# Altium schematic sheet Dionysus_FPGA.SchDoc: FPGA
size B; CompanyName: Cospan Design; DrawnBy: David McCoy; Engineer: David McCoy; DocumentNumber: 2; Revision: B; SheetNumber: 2; SheetTotal: 8
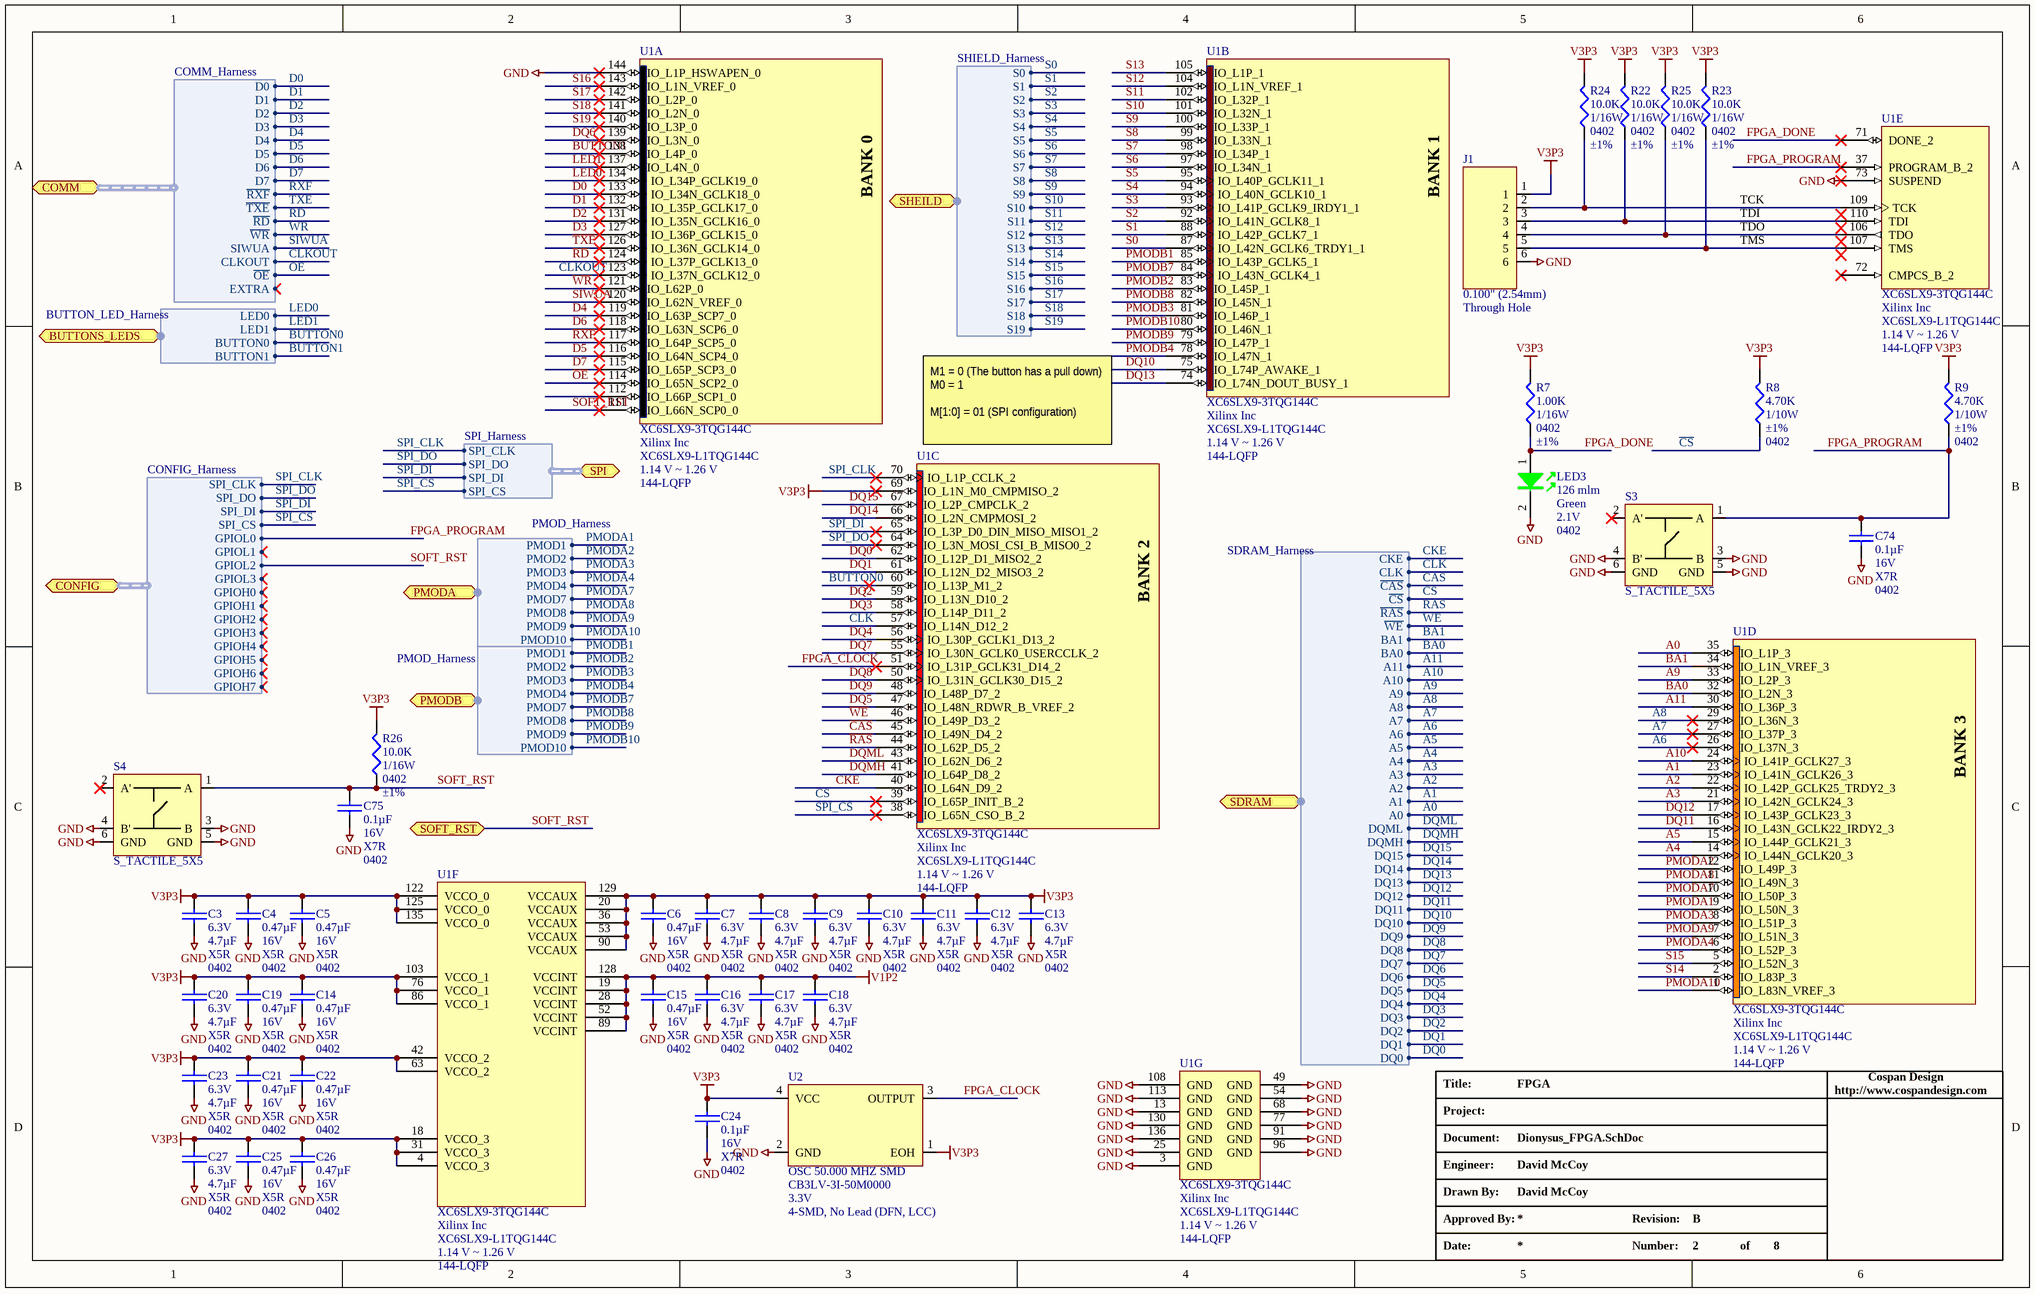
[diagram p0: Dionysus_FPGA.SchDoc]

## Parts
C3  Voltage - Rated: 6.3V  Capacitance: 4.7µF  Temperature Coefficient: X5R  Package / Case: 0402  [C_ERA-0402]  (hidden comment: 4.7uF)
C4  Capacitance: 0.47µF  Voltage - Rated: 16V  Temperature Coefficient: X5R  Package / Case: 0402  [C_ERA-0402]  (hidden comment: 0.47uF)
C5  Capacitance: 0.47µF  Voltage - Rated: 16V  Temperature Coefficient: X5R  Package / Case: 0402  [C_ERA-0402]  (hidden comment: 0.47uF)
C6  Capacitance: 0.47µF  Voltage - Rated: 16V  Temperature Coefficient: X5R  Package / Case: 0402  [C_ERA-0402]  (hidden comment: 0.47uF)
C7  Voltage - Rated: 6.3V  Capacitance: 4.7µF  Temperature Coefficient: X5R  Package / Case: 0402  [C_ERA-0402]  (hidden comment: 4.7uF)
C8  Voltage - Rated: 6.3V  Capacitance: 4.7µF  Temperature Coefficient: X5R  Package / Case: 0402  [C_ERA-0402]  (hidden comment: 4.7uF)
C9  Voltage - Rated: 6.3V  Capacitance: 4.7µF  Temperature Coefficient: X5R  Package / Case: 0402  [C_ERA-0402]  (hidden comment: 4.7uF)
C10  Voltage - Rated: 6.3V  Capacitance: 4.7µF  Temperature Coefficient: X5R  Package / Case: 0402  [C_ERA-0402]  (hidden comment: 4.7uF)
C11  Voltage - Rated: 6.3V  Capacitance: 4.7µF  Temperature Coefficient: X5R  Package / Case: 0402  [C_ERA-0402]  (hidden comment: 4.7uF)
C12  Voltage - Rated: 6.3V  Capacitance: 4.7µF  Temperature Coefficient: X5R  Package / Case: 0402  [C_ERA-0402]  (hidden comment: 4.7uF)
C13  Voltage - Rated: 6.3V  Capacitance: 4.7µF  Temperature Coefficient: X5R  Package / Case: 0402  [C_ERA-0402]  (hidden comment: 4.7uF)
C14  Capacitance: 0.47µF  Voltage - Rated: 16V  Temperature Coefficient: X5R  Package / Case: 0402  [C_ERA-0402]  (hidden comment: 0.47uF)
C15  Capacitance: 0.47µF  Voltage - Rated: 16V  Temperature Coefficient: X5R  Package / Case: 0402  [C_ERA-0402]  (hidden comment: 0.47uF)
C16  Voltage - Rated: 6.3V  Capacitance: 4.7µF  Temperature Coefficient: X5R  Package / Case: 0402  [C_ERA-0402]  (hidden comment: 4.7uF)
C17  Voltage - Rated: 6.3V  Capacitance: 4.7µF  Temperature Coefficient: X5R  Package / Case: 0402  [C_ERA-0402]  (hidden comment: 4.7uF)
C18  Voltage - Rated: 6.3V  Capacitance: 4.7µF  Temperature Coefficient: X5R  Package / Case: 0402  [C_ERA-0402]  (hidden comment: 4.7uF)
C19  Capacitance: 0.47µF  Voltage - Rated: 16V  Temperature Coefficient: X5R  Package / Case: 0402  [C_ERA-0402]  (hidden comment: 0.47uF)
C20  Voltage - Rated: 6.3V  Capacitance: 4.7µF  Temperature Coefficient: X5R  Package / Case: 0402  [C_ERA-0402]  (hidden comment: 4.7uF)
C21  Capacitance: 0.47µF  Voltage - Rated: 16V  Temperature Coefficient: X5R  Package / Case: 0402  [C_ERA-0402]  (hidden comment: 0.47uF)
C22  Capacitance: 0.47µF  Voltage - Rated: 16V  Temperature Coefficient: X5R  Package / Case: 0402  [C_ERA-0402]  (hidden comment: 0.47uF)
C23  Voltage - Rated: 6.3V  Capacitance: 4.7µF  Temperature Coefficient: X5R  Package / Case: 0402  [C_ERA-0402]  (hidden comment: 4.7uF)
C24  Capacitance: 0.1µF  Voltage - Rated: 16V  Temperature Coefficient: X7R  Package / Case: 0402  [C_ERA-0402]  (hidden comment: 0.1uF)
C25  Capacitance: 0.47µF  Voltage - Rated: 16V  Temperature Coefficient: X5R  Package / Case: 0402  [C_ERA-0402]  (hidden comment: 0.47uF)
C26  Capacitance: 0.47µF  Voltage - Rated: 16V  Temperature Coefficient: X5R  Package / Case: 0402  [C_ERA-0402]  (hidden comment: 0.47uF)
C27  Voltage - Rated: 6.3V  Capacitance: 4.7µF  Temperature Coefficient: X5R  Package / Case: 0402  [C_ERA-0402]  (hidden comment: 4.7uF)
C74  Capacitance: 0.1µF  Voltage - Rated: 16V  Temperature Coefficient: X7R  Package / Case: 0402  [C_ERA-0402]  (hidden comment: 0.1uF)
C75  Capacitance: 0.1µF  Voltage - Rated: 16V  Temperature Coefficient: X7R  Package / Case: 0402  [C_ERA-0402]  (hidden comment: 0.1uF)
J1  Pitch: 0.100" (2.54mm)  Mounting Type: Through Hole  [HDR_1X6]  (hidden comment: J_HDR1X6_THRHOLE_VERT)
LED3  Luminous Flux @ Current - Test: 126 mlm  Color: Green  Voltage - Forward (Vf) Typ: 2.1V  Package / Case: 0402  [DIOM1005X07L_GREEN]  (hidden comment: LED_GRN_0402)
R7  Resistance In Ohms: 1.00K  Power (Watts): 1/16W  Case: 0402  Tolerance: ±1%  [ERA-0402]  (hidden comment: 1.0k Ohms)
R8  Resistance In Ohms: 4.70K  Power (Watts): 1/10W  Tolerance: ±1%  Case: 0402  [ERA-0402]  (hidden comment: 4.7k Ohms)
R9  Resistance In Ohms: 4.70K  Power (Watts): 1/10W  Tolerance: ±1%  Case: 0402  [ERA-0402]  (hidden comment: 4.7k Ohms)
R22  Resistance In Ohms: 10.0K  Power (Watts): 1/16W  Case: 0402  Tolerance: ±1%  [ERA-0402]  (hidden comment: R_0402_10.0K)
R23  Resistance In Ohms: 10.0K  Power (Watts): 1/16W  Case: 0402  Tolerance: ±1%  [ERA-0402]  (hidden comment: R_0402_10.0K)
R24  Resistance In Ohms: 10.0K  Power (Watts): 1/16W  Case: 0402  Tolerance: ±1%  [ERA-0402]  (hidden comment: R_0402_10.0K)
R25  Resistance In Ohms: 10.0K  Power (Watts): 1/16W  Case: 0402  Tolerance: ±1%  [ERA-0402]  (hidden comment: R_0402_10.0K)
R26  Resistance In Ohms: 10.0K  Power (Watts): 1/16W  Case: 0402  Tolerance: ±1%  [ERA-0402]  (hidden comment: R_0402_10.0K)
S3  S_TACTILE_5X5  [TACTILE_BUTTON_5X5]
S4  S_TACTILE_5X5  [TACTILE_BUTTON_5X5]
U1  XC6SLX9-3TQG144C  Manufacturer: Xilinx Inc  Manufacturer Part Number: XC6SLX9-L1TQG144C  Voltage - Supply: 1.14 V ~ 1.26 V  Package / Case: 144-LQFP  [TQG144_N]  (parts A,B,C,D,E,F,G of 7)
U2  OSC 50.000 MHZ SMD  Manufacturer Part Number: CB3LV-3I-50M0000  Supply Voltage: 3.3V  Package / Case: 4-SMD, No Lead (DFN, LCC)  [SMD_OSC_12MHZ]

## Ports
BUTTONS_LEDS (harness BUTTON_LED_Harness), COMM (harness COMM_Harness), CONFIG (harness CONFIG_Harness), PMODA (harness PMOD_Harness), PMODB (harness PMOD_Harness), SDRAM (harness SDRAM_Harness), SHEILD (harness SHIELD_Harness), SOFT_RST, SPI (harness SPI_Harness)

## Harnesses
CONFIG_Harness: SPI_CLK, SPI_DO, SPI_DI, SPI_CS, GPIOL0, GPIOL1, GPIOL2, GPIOL3, GPIOH0, GPIOH1, GPIOH2, GPIOH3, GPIOH4, GPIOH5, GPIOH6, GPIOH7
COMM_Harness: D0, D1, D2, D3, D4, D5, D6, D7, ~{RXF}, ~{TXE}, ~{RD}, ~{WR}, SIWUA, CLKOUT, ~{OE}, EXTRA
BUTTON_LED_Harness: LED0, LED1, BUTTON0, BUTTON1
SDRAM_Harness: CKE, CLK, ~{CAS}, ~{CS}, ~{RAS}, ~{WE}, BA1, BA0, A11, A10, A9, A8, A7, A6, A5, A4, A3, A2, A1, A0, DQML, DQMH, DQ15, DQ14, DQ13, DQ12, DQ11, DQ10, DQ9, DQ8, DQ7, DQ6, DQ5, DQ4, DQ3, DQ2, DQ1, DQ0
SHIELD_Harness: S0, S1, S2, S3, S4, S5, S6, S7, S8, S9, S10, S11, S12, S13, S14, S15, S16, S17, S18, S19
SPI_Harness: SPI_CLK, SPI_DO, SPI_DI, SPI_CS
PMOD_Harness: PMOD1, PMOD2, PMOD3, PMOD4, PMOD7, PMOD8, PMOD9, PMOD10

## Nets
GND: C3.1 C4.1 C5.1 C6.1 C7.1 C8.1 C9.1 C10.1 C11.1 C12.1 C13.1 C14.1 C15.1 C16.1 C17.1 C18.1 C19.1 C20.1 C21.1 C22.1 C23.1 C24.1 C25.1 C26.1 C27.1 C74.1 C75.1 J1.6 LED3.2 S3.3(B) S3.4(B') S3.5(GND) S3.6(GND) S4.3(B) S4.4(B') S4.5(GND) S4.6(GND) U1.3(GND) U1.13(GND) U1.25(GND) U1.49(GND) U1.54(GND) U1.68(GND) U1.73(SUSPEND) U1.77(GND) U1.91(GND) U1.96(GND) U1.108(GND) U1.113(GND) U1.130(GND) U1.136(GND) U1.144(IO_L1P_HSWAPEN_0) U2.2(GND)
V1P2: C15.2 C16.2 C17.2 C18.2 U1.19(VCCINT) U1.28(VCCINT) U1.52(VCCINT) U1.89(VCCINT) U1.128(VCCINT)
V3P3: C3.2 C4.2 C5.2 C6.2 C7.2 C8.2 C9.2 C10.2 C11.2 C12.2 C13.2 C14.2 C19.2 C20.2 C21.2 C22.2 C23.2 C24.2 C25.2 C26.2 C27.2 J1.1 R7.1 R8.1 R9.1 R22.1 R23.1 R24.1 R25.1 R26.1 U1.4(VCCO_3) U1.18(VCCO_3) U1.20(VCCAUX) U1.31(VCCO_3) U1.36(VCCAUX) U1.42(VCCO_2) U1.53(VCCAUX) U1.63(VCCO_2) U1.69(IO_L1N_M0_CMPMISO_2) U1.76(VCCO_1) U1.86(VCCO_1) U1.90(VCCAUX) U1.103(VCCO_1) U1.122(VCCO_0) U1.125(VCCO_0) U1.129(VCCAUX) U1.135(VCCO_0) U2.1(EOH) U2.4(VCC)
A0: U1.35(IO_L1P_3) ; port SDRAM.A0
A1: U1.23(IO_L41N_GCLK26_3) ; port SDRAM.A1
A2: U1.22(IO_L42P_GCLK25_TRDY2_3) ; port SDRAM.A2
A3: U1.21(IO_L42N_GCLK24_3) ; port SDRAM.A3
A4: U1.14(IO_L44N_GCLK20_3) ; port SDRAM.A4
A5: U1.15(IO_L44P_GCLK21_3) ; port SDRAM.A5
A6: U1.26(IO_L37N_3) ; port SDRAM.A6
A7: U1.27(IO_L37P_3) ; port SDRAM.A7
A8: U1.29(IO_L36N_3) ; port SDRAM.A8
A9: U1.33(IO_L2P_3) ; port SDRAM.A9
A10: U1.24(IO_L41P_GCLK27_3) ; port SDRAM.A10
A11: U1.30(IO_L36P_3) ; port SDRAM.A11
BA0: U1.32(IO_L2N_3) ; port SDRAM.BA0
BA1: U1.34(IO_L1N_VREF_3) ; port SDRAM.BA1
BUTTON0: U1.60(IO_L13P_M1_2) ; port BUTTONS_LEDS.BUTTON0
BUTTON1: U1.138(IO_L4P_0) ; port BUTTONS_LEDS.BUTTON1
~{CAS}: U1.45(IO_L49N_D4_2) ; port SDRAM.~{CAS}
~{CS}: R8.2 U1.39(IO_L65P_INIT_B_2) ; port SDRAM.~{CS}
CKE: U1.40(IO_L64N_D9_2) ; port SDRAM.CKE
CLK: U1.57(IO_L14N_D12_2) ; port SDRAM.CLK
CLKOUT: U1.123(IO_L37N_GCLK12_0) ; port COMM.CLKOUT
D0: U1.133(IO_L34N_GCLK18_0) ; port COMM.D0
D1: U1.132(IO_L35P_GCLK17_0) ; port COMM.D1
D2: U1.131(IO_L35N_GCLK16_0) ; port COMM.D2
D3: U1.127(IO_L36P_GCLK15_0) ; port COMM.D3
D4: U1.119(IO_L63P_SCP7_0) ; port COMM.D4
D5: U1.116(IO_L64N_SCP4_0) ; port COMM.D5
D6: U1.118(IO_L63N_SCP6_0) ; port COMM.D6
D7: U1.115(IO_L65P_SCP3_0) ; port COMM.D7
DQ0: U1.62(IO_L12P_D1_MISO2_2) ; port SDRAM.DQ0
DQ1: U1.61(IO_L12N_D2_MISO3_2) ; port SDRAM.DQ1
DQ2: U1.59(IO_L13N_D10_2) ; port SDRAM.DQ2
DQ3: U1.58(IO_L14P_D11_2) ; port SDRAM.DQ3
DQ4: U1.56(IO_L30P_GCLK1_D13_2) ; port SDRAM.DQ4
DQ5: U1.47(IO_L48N_RDWR_B_VREF_2) ; port SDRAM.DQ5
DQ6: U1.139(IO_L3N_0) ; port SDRAM.DQ6
DQ7: U1.55(IO_L30N_GCLK0_USERCCLK_2) ; port SDRAM.DQ7
DQ8: U1.50(IO_L31N_GCLK30_D15_2) ; port SDRAM.DQ8
DQ9: U1.48(IO_L48P_D7_2) ; port SDRAM.DQ9
DQ10: U1.75(IO_L74P_AWAKE_1) ; port SDRAM.DQ10
DQ11: U1.16(IO_L43N_GCLK22_IRDY2_3) ; port SDRAM.DQ11
DQ12: U1.17(IO_L43P_GCLK23_3) ; port SDRAM.DQ12
DQ13: U1.74(IO_L74N_DOUT_BUSY_1) ; port SDRAM.DQ13
DQ14: U1.66(IO_L2N_CMPMOSI_2) ; port SDRAM.DQ14
DQ15: U1.67(IO_L2P_CMPCLK_2) ; port SDRAM.DQ15
DQMH: U1.41(IO_L64P_D8_2) ; port SDRAM.DQMH
DQML: U1.43(IO_L62N_D6_2) ; port SDRAM.DQML
FPGA_CLOCK: U1.51(IO_L31P_GCLK31_D14_2) U2.3(OUTPUT)
FPGA_DONE: LED3.1 R7.2 U1.71(DONE_2)
FPGA_PROGRAM: C74.2 R9.2 S3.1(A) U1.37(PROGRAM_B_2) ; port CONFIG.GPIOL0
LED0: U1.134(IO_L34P_GCLK19_0) ; port BUTTONS_LEDS.LED0
LED1: U1.137(IO_L4N_0) ; port BUTTONS_LEDS.LED1
~{OE}: U1.114(IO_L65N_SCP2_0) ; port COMM.~{OE}
PMODA1: U1.9(IO_L50N_3) ; port PMODA.PMOD1
PMODA2: U1.12(IO_L49P_3) ; port PMODA.PMOD2
PMODA3: U1.8(IO_L51P_3) ; port PMODA.PMOD3
PMODA4: U1.6(IO_L52P_3) ; port PMODA.PMOD4
PMODA7: U1.10(IO_L50P_3) ; port PMODA.PMOD7
PMODA8: U1.11(IO_L49N_3) ; port PMODA.PMOD8
PMODA9: U1.7(IO_L51N_3) ; port PMODA.PMOD9
PMODA10: U1.1(IO_L83N_VREF_3) ; port PMODA.PMOD10
PMODB1: U1.85(IO_L43P_GCLK5_1) ; port PMODB.PMOD1
PMODB2: U1.83(IO_L45P_1) ; port PMODB.PMOD2
PMODB3: U1.81(IO_L46P_1) ; port PMODB.PMOD3
PMODB4: U1.78(IO_L47N_1) ; port PMODB.PMOD4
PMODB7: U1.84(IO_L43N_GCLK4_1) ; port PMODB.PMOD7
PMODB8: U1.82(IO_L45N_1) ; port PMODB.PMOD8
PMODB9: U1.79(IO_L47P_1) ; port PMODB.PMOD9
PMODB10: U1.80(IO_L46N_1) ; port PMODB.PMOD10
~{RAS}: U1.44(IO_L62P_D5_2) ; port SDRAM.~{RAS}
~{RD}: U1.124(IO_L37P_GCLK13_0) ; port COMM.~{RD}
~{RXF}: U1.117(IO_L64P_SCP5_0) ; port COMM.~{RXF}
S0: U1.87(IO_L42N_GCLK6_TRDY1_1) ; port SHEILD.S0
S1: U1.88(IO_L42P_GCLK7_1) ; port SHEILD.S1
S2: U1.92(IO_L41N_GCLK8_1) ; port SHEILD.S2
S3: U1.93(IO_L41P_GCLK9_IRDY1_1) ; port SHEILD.S3
S4: U1.94(IO_L40N_GCLK10_1) ; port SHEILD.S4
S5: U1.95(IO_L40P_GCLK11_1) ; port SHEILD.S5
S6: U1.97(IO_L34N_1) ; port SHEILD.S6
S7: U1.98(IO_L34P_1) ; port SHEILD.S7
S8: U1.99(IO_L33N_1) ; port SHEILD.S8
S9: U1.100(IO_L33P_1) ; port SHEILD.S9
S10: U1.101(IO_L32N_1) ; port SHEILD.S10
S11: U1.102(IO_L32P_1) ; port SHEILD.S11
S12: U1.104(IO_L1N_VREF_1) ; port SHEILD.S12
S13: U1.105(IO_L1P_1) ; port SHEILD.S13
S14: U1.2(IO_L83P_3) ; port SHEILD.S14
S15: U1.5(IO_L52N_3) ; port SHEILD.S15
S16: U1.143(IO_L1N_VREF_0) ; port SHEILD.S16
S17: U1.142(IO_L2P_0) ; port SHEILD.S17
S18: U1.141(IO_L2N_0) ; port SHEILD.S18
S19: U1.140(IO_L3P_0) ; port SHEILD.S19
SIWUA: U1.120(IO_L62N_VREF_0) ; port COMM.SIWUA
SOFT_RST: C75.2 R26.2 S4.1(A) U1.111(IO_L66N_SCP0_0) ; port SOFT_RST, port CONFIG.GPIOL2
SPI_CLK: U1.70(IO_L1P_CCLK_2) ; port CONFIG.SPI_CLK, port SPI.SPI_CLK
SPI_CS: U1.38(IO_L65N_CSO_B_2) ; port CONFIG.SPI_CS, port SPI.SPI_CS
SPI_DI: U1.65(IO_L3P_D0_DIN_MISO_MISO1_2) ; port CONFIG.SPI_DI, port SPI.SPI_DI
SPI_DO: U1.64(IO_L3N_MOSI_CSI_B_MISO0_2) ; port CONFIG.SPI_DO, port SPI.SPI_DO
~{TXE}: U1.126(IO_L36N_GCLK14_0) ; port COMM.~{TXE}
TCK: J1.2 R24.2 U1.109(TCK)
TDI: J1.3 R22.2 U1.110(TDI)
TDO: J1.4 R25.2 U1.106(TDO)
TMS: J1.5 R23.2 U1.107(TMS)
~{WE}: U1.46(IO_L49P_D3_2) ; port SDRAM.~{WE}
~{WR}: U1.121(IO_L62P_0) ; port COMM.~{WR}

Not connected (* = marked no-connect by the designer): S3 2(A')*; S4 2(A')*; U1 72(CMPCS_B_2)* 112(IO_L66P_SCP1_0)*

## Notes on the sheet
- An 8-pin header is used instead of a 6 pin header just in case the user accidentally attaches the connector in reverse it won't damage anything... hopefully
- DONE: when pulled high indicates FPGA is programmed
  INIT: when held low this will delay configuration, tied high with a pull up so it wont delay configuration
  PROGRAM: Active low chip reset, initiates a program cycle
  SUSPEND: Holds the FPGA in a suspended mode, keeps configuration (tied to ground because its not used)
  CMPCS: Reserved, and left unconnected (per specification)
  HSWAPEN: When pulled high disables internal pull ups
- (near U1) M1 = 0 (The button has a pull down)
  M0 = 1
  M[1:0] = 01 (SPI configuration)
- REV B Notes:
  Changed to Button 0 to M0 because the M0 needs to be pulled up and button 0 is already pulled up
  M1 needs to be pulled down
  Fixed the Done pin, the resistor needs to pull up the DONE pin instead of in series with the resistor
  Removed the resistor that was in series with the Program Button
- Need to determin if I can use this GPIO to pulse the FPGA program pin
  yes!
- Title:
- http://www.cospandesign.com
- Cospan Design
- Project:
- Document:
- Engineer:
- Drawn By:
- Approved By:
- Revision:
- Date:
- Number:
- of
- (in symbol U_XC6SLX9-3TQG144C, part A) BANK 0
- (in symbol U_XC6SLX9-3TQG144C, part B) BANK 1
- (in symbol U_XC6SLX9-3TQG144C, part C) BANK 2
- (in symbol U_XC6SLX9-3TQG144C, part D) BANK 3

## Library data of the parts
C3 C7-C13 C16-C18 C20 C23 C27 = C_0402_4.7UF: CAP CER 4.7UF 6.3V X5R 0402; Manufacturer: Murata Electronics North America; Manufacturer Part Number: GRM155R60J475ME87D; Tolerance: ±20%; Supplier 1: Digi-Key; Supplier Part Number 1: 445-7395-1-ND; RoHS: RoHS Compliant; Category: Capacitors; Stock 1: 1176918; Pricing: 1=0.46, 10=0.365, 50=0.264, 100=0.22, 250=0.165, 500=0.1408, 1000=0.11, 5000=0.0836 (USD); Mounting Type: Surface Mount, MLCC; Operating Temperature: -55°C ~ 85°C; Applications: General Purpose; Ratings: -; Size / Dimension: 0.039" L x 0.020" W (1.00mm x 0.50mm); Height: -; Thickness: 0.022" (0.55mm); Lead Spacing: -; Features: -; Packaging: Cut Tape (CT); Lead Style: -; ComponentLink1URL: http://www.murata.com/products/catalog/pdf/c02e.pdf; ComponentLink1Description: http://www.murata.com/products/catalog/pdf/c02e.pdf; Stock 2: 8098; Pricing 2: 1=0.32, 10=0.28, 100=0.14, 250=0.112, 500=0.102, 1000=0.092, 5000=0.076 (USD); Height - Seated (Max): -; Thickness (Max): 0.026" (0.65mm); ComponentLink2URL: http://www.tdk.com/pdf/general_B11.pdf; ComponentLink2Description: http://www.tdk.com/pdf/general_B11.pdf
C4-C6 C14 C15 C19 C21 C22 C25 C26 = C_0402_0.47UF: CAP CER .47UF 16V X5R 0402; Manufacturer: TDK Corporation; Manufacturer Part Number: C1005X5R1C474K; Tolerance: ±10%; Supplier 1: Digi-Key; Supplier Part Number 1: 445-4976-1-ND; RoHS: RoHS Compliant; Category: Capacitors; Stock 1: 387490; Pricing: 10=0.088, 100=0.052, 500=0.03, 1000=0.0208 (USD); Mounting Type: Surface Mount, MLCC; Operating Temperature: -55°C ~ 85°C; Features: Low ESR; Applications: General Purpose; Ratings: -; Size / Dimension: 0.039" L x 0.020" W (1.00mm x 0.50mm); Lead Spacing: -; Thickness: 0.50mm; Packaging: Cut Tape (CT); Lead Style: -; ComponentLink1URL: http://www.tdk.co.jp/tefe02/e412_c.pdf; ComponentLink1Description: http://www.tdk.co.jp/tefe02/e412_c.pdf
C24 C74 C75 = C_0402_0.1UF_16V: CAP CER .10UF 16V X7R 0402; Manufacturer: TDK Corporation; Manufacturer Part Number: C1005X7R1C104K; Tolerance: ±10%; Supplier 1: Digi-Key; Supplier Part Number 1: 445-4952-1-ND; RoHS: RoHS Compliant; Category: Capacitors; Stock 1: 230800; Pricing: 10=0.024, 100=0.0143, 500=0.00826, 1000=0.00572 (USD); Mounting Type: Surface Mount, MLCC; Features: General Purpose; Lead Spacing: -; Thickness: 0.50mm; Packaging: Cut Tape (CT); ComponentLink1URL: http://www.tdk.co.jp/tefe02/e412_c.pdf; ComponentLink1Description: http://www.tdk.co.jp/tefe02/e412_c.pdf; Operating Temperature: -55°C ~ 125°C
J1 = J_HDR1X6_THRHOLE_VERT: CONN HEADER .100" 12POS TIN PCB; Manufacturer: Samtec; Manufacturer Part Number: TSW-106-07-T-S; Connector Type: Unshrouded; Number of Positions: 6; Number of Positions Loaded: All; Supplier 1: Samtec; Supplier Part Number 1: TSW-106-07-T-S; RoHS: RoHS Compliant; Category: Connectors, Interconnects; Stock 1: 0; Number of Rows: 1; Row Spacing: -; Height Stacking (Mating): -; Height Above Board: 0.100" (2.54mm); Contact Mating Length: 0.166" (4.22mm); Termination: Solder; Contact Finish: Tin; Contact Finish Thickness: 200µin (5.08µm); Features: -; Color: Black; Packaging: Bulk; ComponentLink1URL: http://www.samtec.com/ftppub/cpdf/TX-MKT1.PDF; ComponentLink1Description: http://www.samtec.com/ftppub/cpdf/TX-MKT1.PDF; Molding Height Above Board: 0.100" (2.54mm); ComponentLink2URL: http://www.samtec.com/ftppub/pdf/TD.PDF; ComponentLink2Description: http://www.samtec.com/ftppub/pdf/TD.PDF; Pricing: 1=0.201
LED3 = LED_GRN_0402: LED 1X0.5MM 570NM GN WTR CLR SMD; Manufacturer: Kingbright Corp; Manufacturer Part Number: APHHS1005CGCK; Current - Test: 20mA; Wavelength - Peak: 574nm; Millicandela Rating: 40mcd; Lens Type: Clear; Lens Style/Size: Rectangle, 0.8mm x 0.5mm; Viewing Angle: 120°; Supplier 1: Digi-Key; Supplier Part Number 1: 754-1101-1-ND; RoHS: RoHS Compliant; Category: Optoelectronics; Stock 1: 3400; Pricing: 1=0.24, 10=0.176, 25=0.1412, 100=0.1293, 250=0.11752, 500=0.10576, 1000=0.094 (USD); Wavelength - Dominant: 570nm; Mounting Type: Surface Mount; Packaging: Cut Tape (CT); Size / Dimension: *; Height: *; ComponentLink1URL: http://www.us.kingbright.com/images/catalog/SPEC/APHHS1005CGCK.pdf; ComponentLink1Description: http://www.us.kingbright.com/images/catalog/SPEC/APHHS1005CGCK.pdf
R7 = R_0402_1.0K: RES 1.00K OHM 1/16W 1% 0402 SMD; Manufacturer: Yageo; Manufacturer Part Number: RC0402FR-071KL; Resistance (Ohms): 1K; Temperature Coefficient: ±100ppm/°C; Supplier 1: Digi-Key; Supplier Part Number 1: 311-1.00KLRCT-ND; RoHS: RoHS Compliant; Category: Resistors; Stock 1: 2103351; Pricing: 10=0.014, 100=0.0063, 500=0.00382, 1000=0.0027, 5000=0.00203 (USD); Composition: Thick Film; Features: -; Package / Case: 0402 (1005 Metric); Size / Dimension: 0.039" L x 0.020" W (1.00mm x 0.50mm); Height: 0.016" (0.40mm); Number of Terminations: 2; Packaging: Cut Tape (CT); ComponentLink1URL: http://www.yageo.com/documents/recent/PYu-RC0402_51_RoHS_L_6.pdf; ComponentLink1Description: http://www.yageo.com/documents/recent/PYu-RC0402_51_RoHS_L_6.pdf
R8 R9 = R_0402_4.70K: RES 4.70K OHM 1/10W 1% 0402 SMD; Manufacturer: Yageo; Manufacturer Part Number: RC0402FR-074K7L; Temperature Coefficient: ±100ppm/°C; Supplier 1: Digi-Key; Supplier Part Number 1: 311-4.7KLRCT-ND; RoHS: RoHS Compliant; Category: Resistors; Stock 1: 3610; Pricing: 10=0.014, 100=0.0063, 500=0.00382, 1000=0.0027, 5000=0.00203 (USD); Composition: Thick Film; Features: -; Size / Dimension: 0.039" L x 0.020" W (1.00mm x 0.50mm); Height: 0.016" (0.40mm); Packaging: Cut Tape (CT); ComponentLink1URL: http://www.yageo.com/documents/recent/PYu-RC0402_51_RoHS_L_6.pdf; ComponentLink1Description: http://www.yageo.com/documents/recent/PYu-RC0402_51_RoHS_L_6.pdf; Resistance (Ohms): 4.7K; Package / Case: 0402 (1005 Metric); Number of Terminations: 2
R22-R26 = R_0402_10.0K: RES 10.0K OHM 1/16W 1% 0402 SMD; Manufacturer: Stackpole Electronics Inc; Manufacturer Part Number: RMCF0402FT10K0; Temperature Coefficient: ±100ppm/°C; Resistance (Ohms): 10k; Supplier 1: Digi-Key; Supplier Part Number 1: RMCF0402FT10K0CT-ND; RoHS: RoHS Compliant; Category: Resistors; Stock 1: 234525; Pricing: 1=0.04, 10=0.025, 50=0.0138, 100=0.0105, 250=0.0078, 500=0.00576, 1000=0.00384, 2500=0.00324, 5000=0.0027 (USD); Composition: Thick Film; Features: -; Packaging: Cut Tape (CT); ComponentLink1URL: http://www.seielect.com/Catalog/SEI-RMCF_RMCP.pdf; ComponentLink1Description: http://www.seielect.com/Catalog/SEI-RMCF_RMCP.pdf; Package / Case: 0402 (1005 Metric); Size / Dimension: 0.039" L x 0.020" W (1.00mm x 0.50mm); Height: 0.016" (0.40mm); Number of Terminations: 2
S3 S4 = S_TACTILE_5X5: SWITCH LT 1.5MM HT 160GF SMD; Manufacturer: Panasonic - ECG; Manufacturer Part Number: EVQ-PLHA15; Circuit: SPST-NO; Switch Function: Off-Mom; Contact Rating @ Voltage: 0.02A @ 15VDC; Actuator Type: Standard; Outline: 4.90mm x 4.90mm; Illumination: Non-Illuminated; Supplier 1: Digi-Key; Supplier Part Number 1: P8046SCT-ND; RoHS: RoHS Compliant; Category: Switches; Stock 1: 86833; Pricing: 1=0.53, 10=0.443, 100=0.3717, 500=0.3186, 1000=0.2655 (USD); Mounting Type: Surface Mount; Orientation: Vertical; Operating Force: 160gf; Packaging: Cut Tape (CT); ComponentLink1URL: http://industrial.panasonic.com/www-data/pdf/ATK0000/ATK0000CE3.pdf; ComponentLink1Description: http://industrial.panasonic.com/www-data/pdf/ATK0000/ATK0000CE3.pdf
U1 = U_XC6SLX9-3TQG144C: IC FPAG SPARTAN 6 9K 144TQFP; Number of Logic Elements/Cells: 9152; Number of LABs/CLBs: 715; Total RAM Bits: 589824; Number of I /O: 102; Supplier 1: Digi-Key; RoHS: RoHS Compliant; Category: Integrated Circuits (ICs); Stock 1: 398; Number of Gates: -; Mounting Type: Surface Mount; Operating Temperature: 0°C ~ 85°C; Supplier Device Package: 144-TQFP (20x20); ComponentLink1URL: http://www.xilinx.com/support/documentation/data_sheets/ds160.pdf; ComponentLink1Description: http://www.xilinx.com/support/documentation/data_sheets/ds160.pdf; Supplier Part Number 1: 122-1747-ND; Pricing: 1=17.22 (USD)
U2 = U_OSC_50MHZ_SMD: OSC 50.0000 MHZ 3.3V SMD; Manufacturer: CTS-Frequency Controls; Frequency: 50MHz; Function: Tri-State (Output Enable); Output: HCMOS, TTL; Frequency Stability: ±50ppm; Current - Supply (Max): 40mA; Current - Supply (Disable) (Max): 10µA; Supplier 1: Digi-Key; Supplier Part Number 1: CTX327LVCT-ND; RoHS: RoHS Compliant; Category: Crystals and Oscillators; Stock 1: 10443; Pricing: 1=2.94, 10=2.551, 50=2.2372, 100=1.7663, 500=1.4915 (USD); Type: XO (Standard); Voltage - Supply: 3.3V; Operating Temperature: -40°C ~ 85°C; Mounting Type: Surface Mount; Size / Dimension: 0.276" L x 0.197" W (7.00mm x 5.00mm); Height: 0.067" (1.70mm); Packaging: Cut Tape (CT); ComponentLink1URL: http://www.ctscorp.com/components/Datasheets/008-0256-0_F.pdf; ComponentLink1Description: http://www.ctscorp.com/components/Datasheets/008-0256-0_F.pdf; COST_1: *; COST_100: *; COST_1000: *; MANF1: *; MANF1_PN: *; MANF2: *; MANF2_PN: *; MANF3: *; MANF3_PN: *; VENDOR1: *; VENDOR1_PN: *